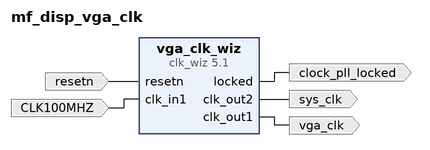
[diagram p0: block diagram of the top level]
# Vivado block design mf_disp_vga_clk, Vivado 2014.4
create_bd_design mf_disp_vga_clk

create_bd_port -dir I -type rst resetn
create_bd_port -dir O -type clk vga_clk
create_bd_port -dir I -type clk CLK100MHZ
set_property -dict {CONFIG.FREQ_HZ 100000000 CONFIG.CLK_DOMAIN mf_disp_vga_clk_sys_clk} [get_bd_ports CLK100MHZ]
create_bd_port -dir O -type clk sys_clk
create_bd_port -dir O clock_pll_locked

create_bd_cell -type ip -vlnv xilinx.com:ip:clk_wiz:5.1 vga_clk_wiz
set_property -dict [list \
  CONFIG.PRIM_IN_FREQ 100.000 \
  CONFIG.USE_INCLK_SWITCHOVER false \
  CONFIG.CLKIN1_JITTER_PS 100.0 \
  CONFIG.CLKIN2_JITTER_PS 100.0 \
  CONFIG.CLKOUT2_USED true \
  CONFIG.NUM_OUT_CLKS 2 \
  CONFIG.CLKOUT1_REQUESTED_OUT_FREQ 25.175 \
  CONFIG.CLKOUT2_REQUESTED_OUT_FREQ 50.000 \
  CONFIG.RESET_TYPE ACTIVE_LOW \
  CONFIG.CLK_IN1_BOARD_INTERFACE Custom \
  CONFIG.CLK_IN2_BOARD_INTERFACE Custom \
  CONFIG.RESET_BOARD_INTERFACE Custom \
  CONFIG.CLKOUT1_JITTER 183.215 \
  CONFIG.CLKOUT1_PHASE_ERROR 105.461 \
  CONFIG.CLKOUT2_JITTER 159.475 \
  CONFIG.CLKOUT2_PHASE_ERROR 105.461 \
] [get_bd_cells vga_clk_wiz]

# ---- connections ----

connect_bd_net [get_bd_ports resetn] [get_bd_pins vga_clk_wiz/resetn]
connect_bd_net [get_bd_pins vga_clk_wiz/clk_out1] [get_bd_ports vga_clk]
connect_bd_net [get_bd_ports CLK100MHZ] [get_bd_pins vga_clk_wiz/clk_in1]
connect_bd_net [get_bd_pins vga_clk_wiz/clk_out2] [get_bd_ports sys_clk]
connect_bd_net [get_bd_pins vga_clk_wiz/locked] [get_bd_ports clock_pll_locked]

validate_bd_design
save_bd_design
